# Altium schematic sheet GC-Sch.SchDoc (part 1 of 2)
size A4; SheetNumber: 1; SheetTotal: 2
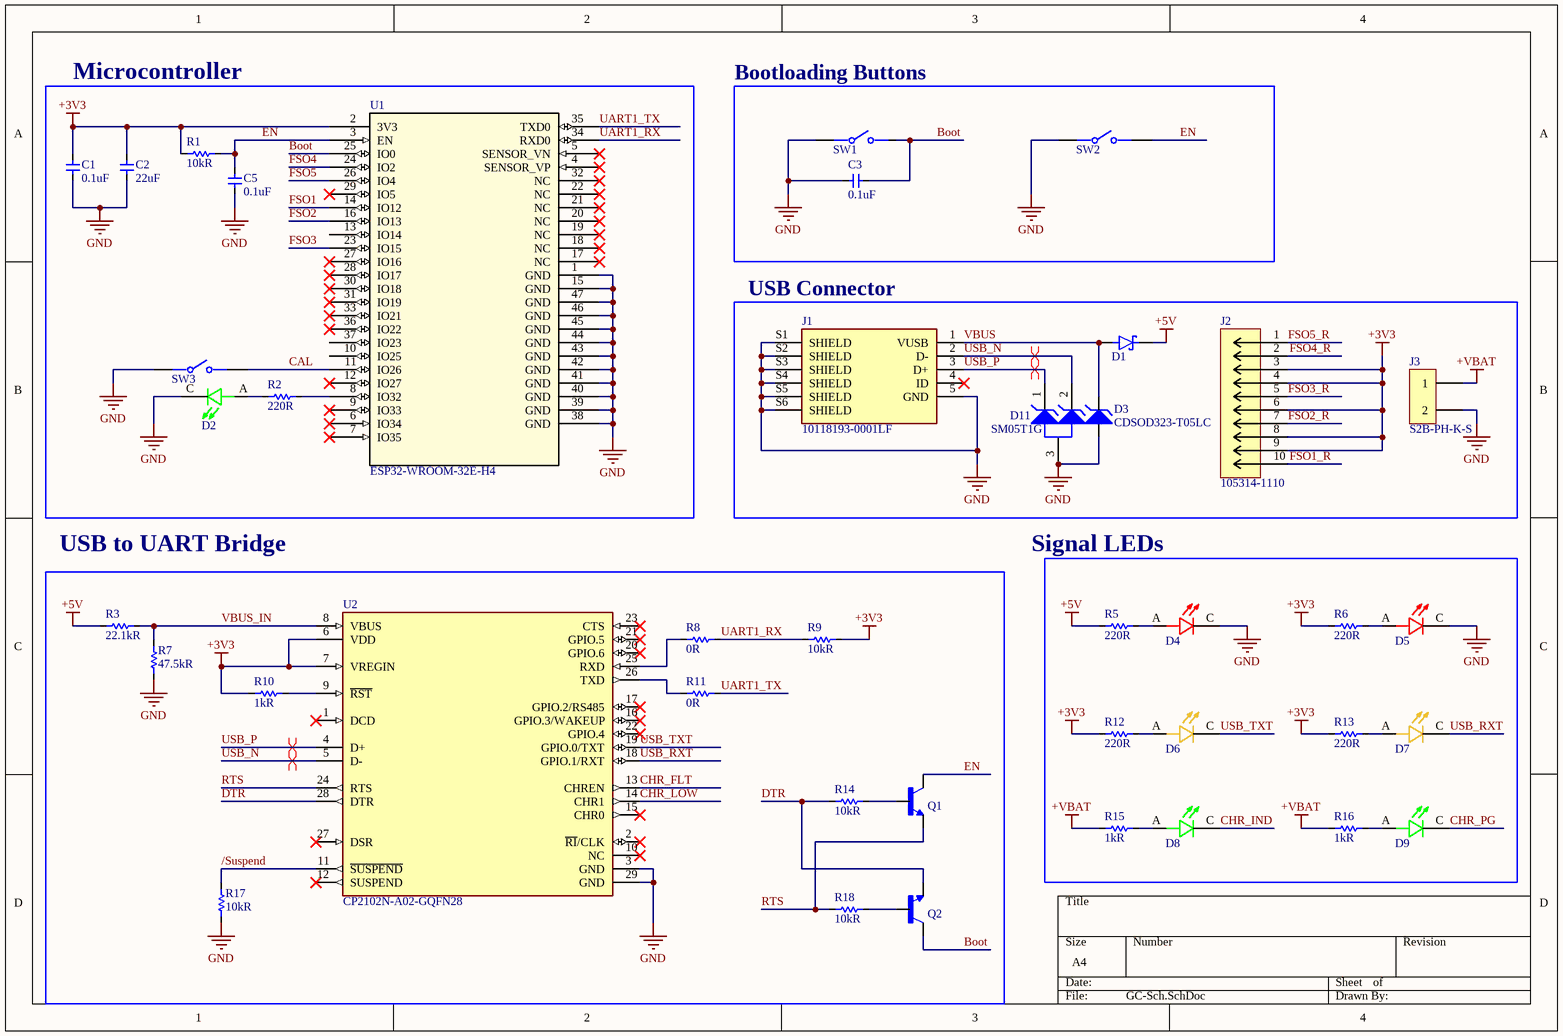
[diagram p0: GC-Sch.SchDoc]

## Parts
C1  Capacitance: 0.1uF  [0603]  (hidden comment: CL10B104JB8NNNC)
C2  Capacitance: 22uF  [0603]  (hidden comment: CL10A226MP8NUNE)
C3  Capacitance: 0.1uF  [0603]  (hidden comment: CL10B104JB8NNNC)
C5  Capacitance: 0.1uF  [0603]  (hidden comment: CL10B104JB8NNNC)
D1  D-BAT760-7  [SOD2513X120N]  (value not drawn)
D2  SML-D12P8WT86  [D-SML-D12U1WT86]  (value not drawn)
D3  CDSOD323-T05LC  [SOD2513X120N]
D4  SML-D12U1WT86  [D-SML-D12U1WT86]  (value not drawn)
D5  SML-D12U1WT86  [D-SML-D12U1WT86]  (value not drawn)
D6  SML-D12Y1WT86  [D-SML-D12U1WT86]  (value not drawn)
D7  SML-D12Y1WT86  [D-SML-D12U1WT86]  (value not drawn)
D8  SML-D12P8WT86  [D-SML-D12U1WT86]  (value not drawn)
D9  SML-D12P8WT86  [D-SML-D12U1WT86]  (value not drawn)
D11  SM05T1G  [ONSC-SOT-23-3-318-08_V]
J1  10118193-0001LF  [AMPHENOL_10118193-0001LF]
J2  105314-1110  [temp]
J3  S2B-PH-K-S  [JST_S2B-PH-K-S(LF)(SN)]
Q1  SS8050-G  [TRANS_SS8050-G]  (value not drawn)
Q2  SS8050-G  [TRANS_SS8050-G]  (value not drawn)
R1  Resistance: 10kR  [0603 - R]  (hidden comment: AC0603FR-1310KL)
R2  Resistance: 220R  [0603 - R]  (hidden comment: R-RMCF0603JT220R)
R3  Resistance: 22.1kR  [0603 - R]  (hidden comment: RMCF0603FT22K1)
R5  Resistance: 220R  [0603 - R]  (hidden comment: R-RMCF0603JT220R)
R6  Resistance: 220R  [0603 - R]  (hidden comment: R-RMCF0603JT220R)
R7  Resistance: 47.5kR  [0603 - R]  (hidden comment: RC0402FR-0747K5L)
R8  Resistance: 0R  [0603 - R]  (hidden comment: ERJ-3GEY0R00V)
R9  Resistance: 10kR  [0603 - R]  (hidden comment: AC0603FR-1310KL)
R10  Resistance: 1kR  [0603 - R]  (hidden comment: RC0603FR-071KL)
R11  Resistance: 0R  [0603 - R]  (hidden comment: ERJ-3GEY0R00V)
R12  Resistance: 220R  [0603 - R]  (hidden comment: R-RMCF0603JT220R)
R13  Resistance: 220R  [0603 - R]  (hidden comment: R-RMCF0603JT220R)
R14  Resistance: 10kR  [0603 - R]  (hidden comment: AC0603FR-1310KL)
R15  Resistance: 1kR  [0603 - R]  (hidden comment: RC0603FR-071KL)
R16  Resistance: 1kR  [0603 - R]  (hidden comment: RC0603FR-071KL)
R17  Resistance: 10kR  [0603 - R]  (hidden comment: AC0603FR-1310KL)
R18  Resistance: 10kR  [0603 - R]  (hidden comment: AC0603FR-1310KL)
SW1  SW-61300211121  [2 Pin Through Hole - Pitch 2.54 mm]  (value not drawn)
SW2  SW-61300211121  [2 Pin Through Hole - Pitch 2.54 mm]  (value not drawn)
SW3  SW-61300211121  [2 Pin Through Hole - Pitch 2.54 mm]  (value not drawn)
U1  ESP32-WROOM-32E-H4  [ESP32­WROOM­32E_EXP]
U2  CP2102N-A02-GQFN28  [FP-CP2102N-A02-GQFN28-IPC_A]

## Blocks framed on the sheet
Microcontroller: C1 C2 C5 D2 R1 R2 SW3 U1
Bootloading Buttons: C3 SW1 SW2
USB Connector: D1 D3 D11 J1-J3
USB to UART Bridge: Q1 Q2 R3 R7-R11 R14 R17 R18 U2

## Nets
+3V3: C1.2 C2.1 J2.3 J2.4 J2.6 J2.8 J2.9 R1.1 R6.1 R9.2 R10.1 R12.1 R13.1 U1.2(3V3) U2.6(VDD) U2.7(VREGIN)
+5V: D1.C(K) R3.1 R5.1
+VBAT: J3.1 R15.1 R16.1
GND: C1.1 C2.2 C3.2 C5.1 D2.C D3.A D4.C D5.C D11.3(A) J1.5(GND) J1.S1(SHIELD) J1.S2(SHIELD) J1.S3(SHIELD) J1.S4(SHIELD) J1.S5(SHIELD) J1.S6(SHIELD) J3.2 R7.1 R17.1 SW1.1 SW2.1 SW3.1 U1.1(GND) U1.15(GND) U1.38(GND) U1.39(GND) U1.40(GND) U1.41(GND) U1.42(GND) U1.43(GND) U1.44(GND) U1.45(GND) U1.46(GND) U1.47(GND) U2.3(GND) U2.29(GND)
/Suspend: R17.2 U2.11(~{SUSPEND})
Boot: C3.1 Q2.3(C) SW1.2 U1.25(IO0)
CAL: SW3.2 U1.11(IO26)
CHR_FLT: U2.13(CHREN)
CHR_IND: D8.C
CHR_LOW: U2.14(CHR1)
CHR_PG: D9.C
DTR: Q2.2(E) R14.1 U2.28(DTR)
EN: C5.2 Q1.3(C) R1.2 SW2.2 U1.3(EN)
FSO1: U1.14(IO12)
FSO1_R: J2.10
FSO2: U1.16(IO13)
FSO2_R: J2.7
FSO3: U1.23(IO15)
FSO3_R: J2.5
FSO4: U1.24(IO2)
FSO4_R: J2.2
FSO5: U1.26(IO4)
FSO5_R: J2.1
RTS: Q1.2(E) R18.1 U2.24(RTS)
UART1_RX: R8.2 R9.1 U1.34(RXD0)
UART1_TX: R11.2 U1.35(TXD0)
USB_N: D11.2(K2) J1.2(D-) U2.5(D-)
USB_P: D11.1(K1) J1.3(D+) U2.4(D+)
USB_RXT: D7.C U2.18(GPIO.1/RXT)
USB_TXT: D6.C U2.19(GPIO.0/TXT)
VBUS: D1.A D3.C J1.1(VUSB)
VBUS_IN: R3.2 R7.2 U2.8(VBUS)
NetD2_A: D2.A R2.2
NetD4_A: D4.A R5.2
NetD5_A: D5.A R6.2
NetD6_A: D6.A R12.2
NetD7_A: D7.A R13.2
NetD8_A: D8.A R15.2
NetD9_A: D9.A R16.2
NetQ1_1: Q1.1(B) R14.2
NetQ2_1: Q2.1(B) R18.2
NetR2_1: R2.1 U1.8(IO32)
NetR8_1: R8.1 U2.25(RXD)
NetR10_2: R10.2 U2.9(~{RST})
NetR11_1: R11.1 U2.26(TXD)

Not connected (* = marked no-connect by the designer): J1 4(ID)*; U1 4(SENSOR_VP)* 5(SENSOR_VN)* 6(IO34)* 7(IO35)* 9(IO33)* 10(IO25) 12(IO27)* 13(IO14) 17(NC)* 18(NC)* 19(NC)* 20(NC)* 21(NC)* 22(NC)* 27(IO16)* 28(IO17)* 29(IO5)* 30(IO18)* 31(IO19)* 32(NC)* 33(IO21)* 36(IO22)* 37(IO23); U2 1(DCD)* 2(~{RI}/CLK)* 10(NC)* 12(SUSPEND)* 15(CHR0)* 16(GPIO.3/WAKEUP)* 17(GPIO.2/RS485)* 20(GPIO.6)* 21(GPIO.5)* 22(GPIO.4)* 23(CTS)* 27(DSR)*

## Layout directives
differential pair: USB_N, USB_P

## Notes on the sheet
- Signal LEDs